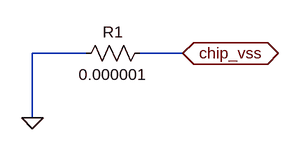
[diagram p0: schematic chip_vss.asc]
chip_vss.asc, the LTspice schematic file:
Version 4
SHEET 1 880 680
WIRE 160 272 80 272
WIRE 304 272 240 272
WIRE 80 368 80 272
FLAG 80 368 0
FLAG 304 272 chip_vss
IOPIN 304 272 BiDir
SYMBOL res 256 256 R90
WINDOW 0 0 56 VBottom 2
WINDOW 3 32 56 VTop 2
SYMATTR InstName R1
SYMATTR Value 0.000001

The netlist it stands for:
* chip_vss.asc
R1 chip_vss 0 0.000001
.backanno
.end